# Altium schematic sheet 01_cover_page.SchDoc: =Proj_Title
size B; Address1: Haleiwa, HI 96712 USA; SheetNumber: 1
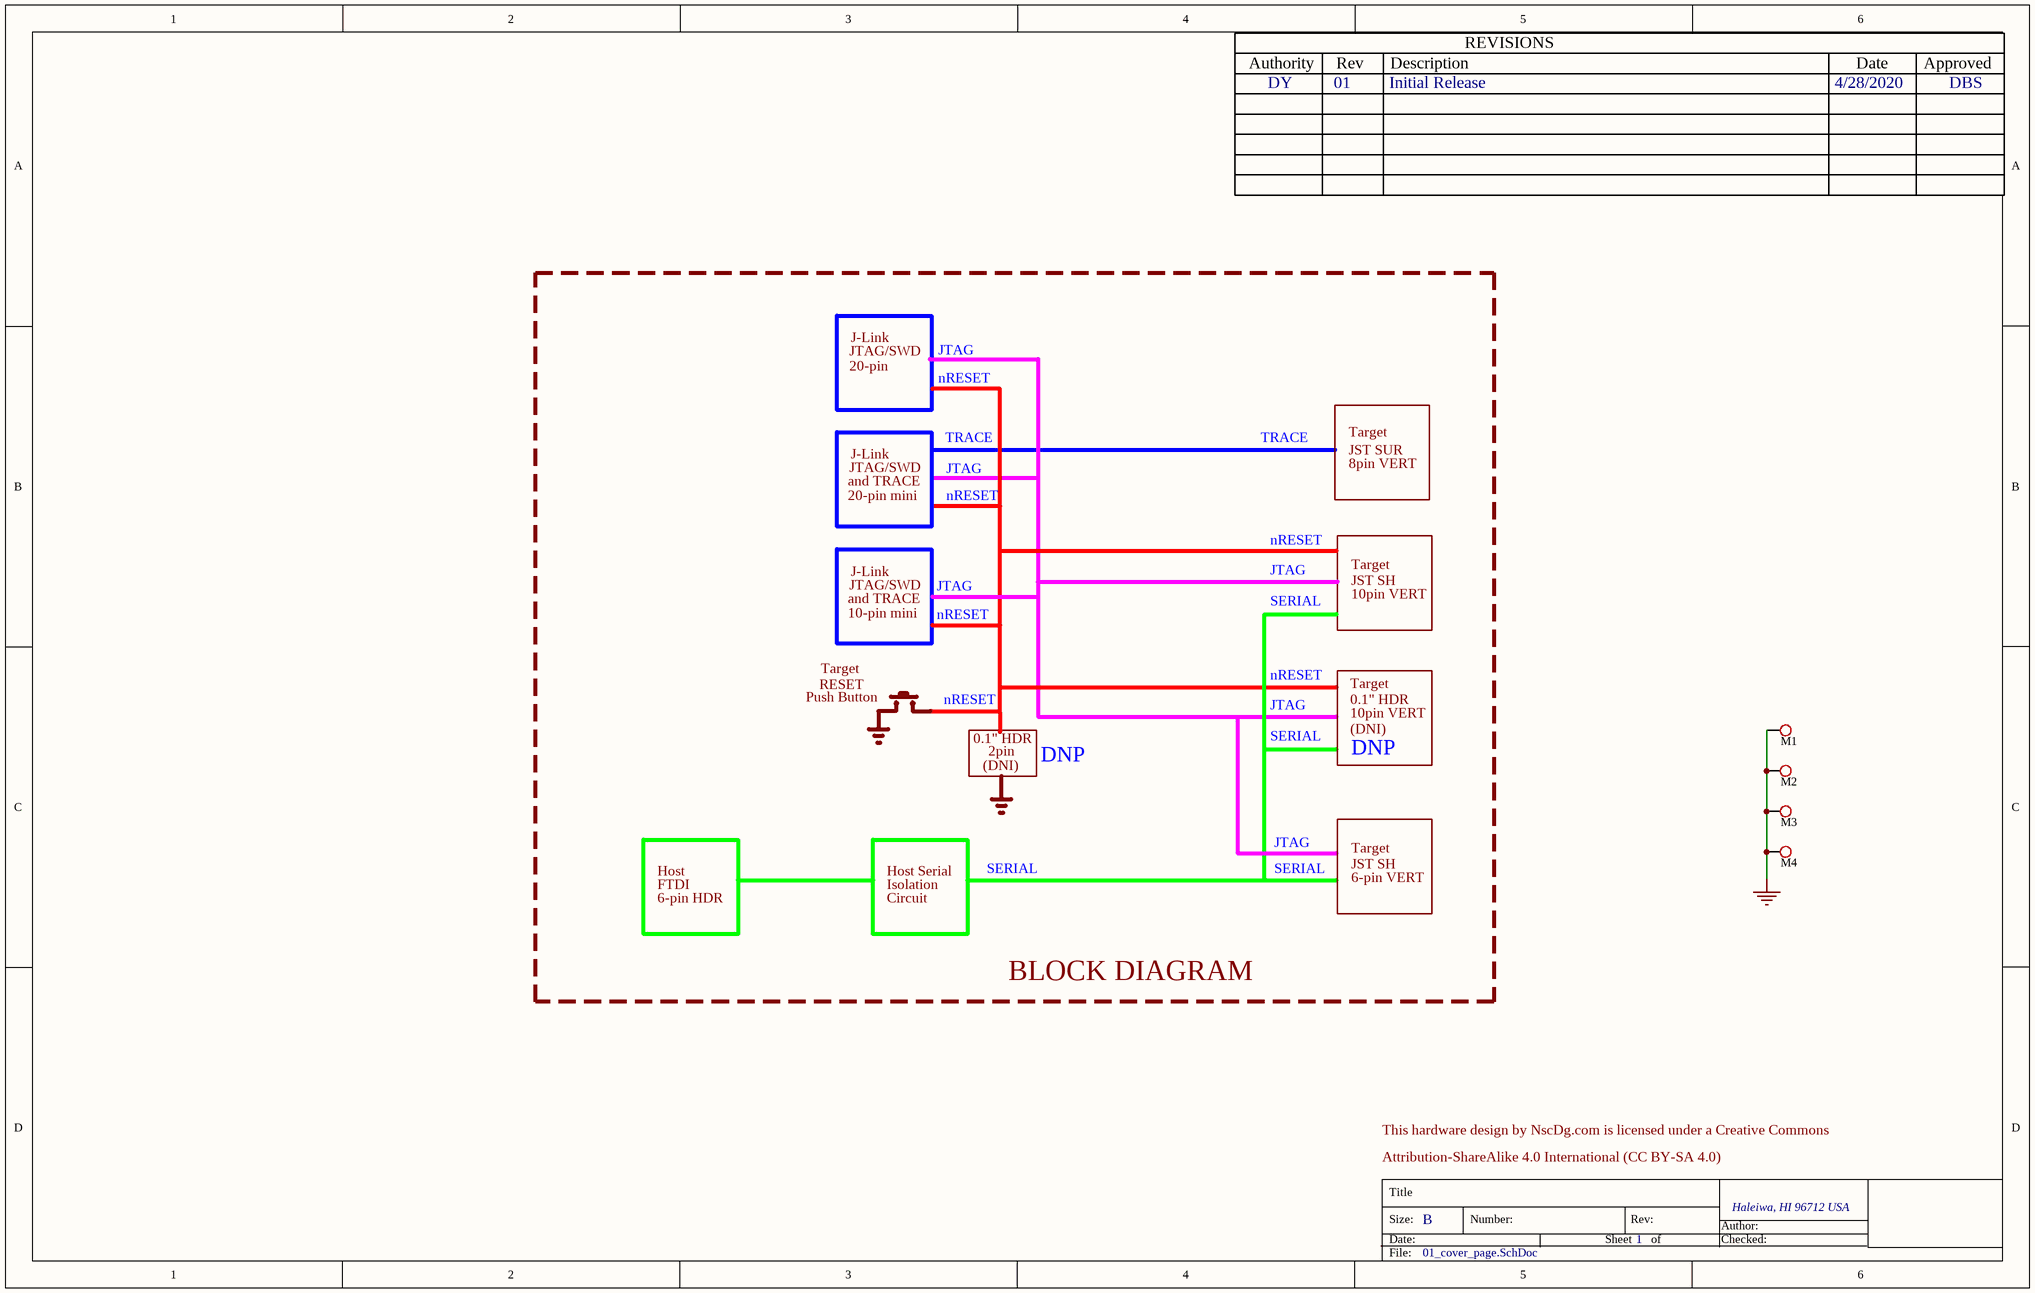
[diagram p0: 01_cover_page.SchDoc]

## Parts
*  REVISION_BLOCK  (value not drawn)  (graphical)
M1  MOUNT HOLE 3MM 8VIAS THMOUNT_HOLE_3MM_TH  [MOUNT_HOLE_3MM_8via_TH]  (value not drawn)
M2  MOUNT HOLE 3MM 8VIAS THMOUNT_HOLE_3MM_TH  [MOUNT_HOLE_3MM_8via_TH]  (value not drawn)
M3  MOUNT HOLE 3MM 8VIAS THMOUNT_HOLE_3MM_TH  [MOUNT_HOLE_3MM_8via_TH]  (value not drawn)
M4  MOUNT HOLE 3MM 8VIAS THMOUNT_HOLE_3MM_TH  [MOUNT_HOLE_3MM_8via_TH]  (value not drawn)

## Nets
GND: M1.1 M2.1 M3.1 M4.1

## Notes on the sheet
- (near *) DY
- 01
- Initial Release
- 4/28/2020
- DBS
- JTAG/SWD
- 20-pin
- J-Link
- JTAG
- nRESET
- Target
- 20-pin mini
- and TRACE
- TRACE
- JST SUR
- 8pin VERT
- 10-pin mini
- SERIAL
- JST SH
- 10pin VERT
- Push Button
- RESET
- 0.1" HDR
- (DNI)
- 2pin
- DNP
- FTDI
- 6-pin HDR
- Host
- Host Serial
- Isolation
- Circuit
- 6-pin VERT
- BLOCK DIAGRAM
- This hardware design by NscDg.com is licensed under a Creative Commons
- Attribution-ShareAlike 4.0 International (CC BY-SA 4.0)
- Title
- Size:
- Date:
- B
- Number:
- Sheet
- Rev:
- of
- Author:
- Checked:
- File:
- (in symbol REVISION_BLOCK) REVISIONS; Authority; Rev; Description; Date; Approved

## Library data of the parts
M1-M4 = MOUNT_HOLE_3MM_8VIAS_TH: MOUNT HOLE 3MM 8VIAS TH; CATEGORY: Mechanical